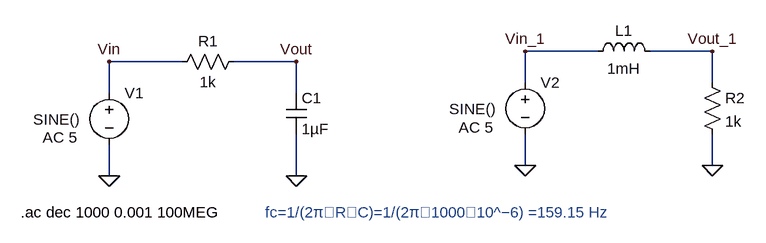
[diagram p0: schematic Lowpass Filter.asc]
Lowpass Filter.asc, the LTspice schematic file:
Version 4
SHEET 1 952 680
WIRE 720 -16 608 -16
WIRE 896 -16 800 -16
WIRE 80 0 -32 0
WIRE 256 0 160 0
WIRE 608 32 608 -16
WIRE 896 32 896 -16
WIRE -32 48 -32 0
WIRE 256 48 256 0
WIRE 608 160 608 112
WIRE 896 160 896 112
WIRE -32 176 -32 128
WIRE 256 176 256 112
FLAG 256 176 0
FLAG -32 176 0
FLAG -32 0 Vin
FLAG 256 0 Vout
FLAG 896 160 0
FLAG 608 160 0
FLAG 608 -16 Vin_1
FLAG 896 -16 Vout_1
SYMBOL voltage -32 32 R0
WINDOW 3 -117 57 Left 2
WINDOW 123 -102 85 Left 2
WINDOW 39 0 0 Left 0
SYMATTR Value SINE()
SYMATTR Value2 AC 5
SYMATTR InstName V1
SYMBOL res 176 -16 R90
WINDOW 0 0 56 VBottom 2
WINDOW 3 32 56 VTop 2
SYMATTR InstName R1
SYMATTR Value 1k
SYMBOL cap 240 48 R0
SYMATTR InstName C1
SYMATTR Value 1µF
SYMBOL voltage 608 16 R0
WINDOW 3 -117 57 Left 2
WINDOW 123 -102 85 Left 2
WINDOW 39 0 0 Left 0
SYMATTR Value SINE()
SYMATTR Value2 AC 5
SYMATTR InstName V2
SYMBOL res 880 16 R0
SYMATTR InstName R2
SYMATTR Value 1k
SYMBOL ind 704 0 R270
WINDOW 0 32 56 VTop 2
WINDOW 3 5 56 VBottom 2
SYMATTR InstName L1
SYMATTR Value 1mH
TEXT -168 232 Left 2 !.ac dec 1000 0.001 100MEG
TEXT 208 232 Left 2 ;fc=1/(2π∗R∗C)=1/(2π∗1000∗10^−6) =159.15 Hz

The netlist it stands for:
* Lowpass Filter.asc
V1 Vin 0 SINE() AC 5
R1 Vout Vin 1k
C1 Vout 0 1µF
V2 Vin_1 0 SINE() AC 5
R2 Vout_1 0 1k
L1 Vin_1 Vout_1 1mH
.ac dec 1000 0.001 100MEG
* fc=1/(2π∗R∗C)=1/(2π∗1000∗10^−6) =159.15 Hz
.backanno
.end